# Altium schematic sheet Sheet1.SchDoc
size A4; SheetNumber: 1; SheetTotal: 1
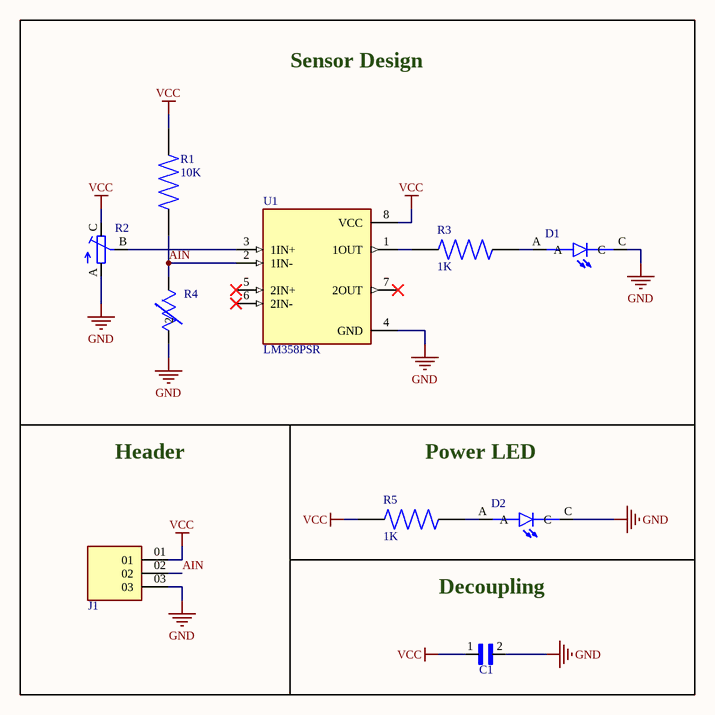
[diagram p0: Sheet1.SchDoc]

## Parts
C1  CEU4J2X7R1H104K125AE  [CAPC2012X150N]  (value not drawn)
D1  597-3305-607F  [LEDC2012X70N]  (value not drawn)
D2  597-3305-607F  [LEDC2012X70N]  (value not drawn)
J1  MTLW-103-XX-XX-S-XXX  [SAMTEC_MTLW-103-XX-XX-S-XXX]  (value not drawn)
R1  10K  [RES_ERJU06J102V]
R2  T93YA103KT20  [TRIM_T93YA103KT20]  (value not drawn)
R3  1K  [RES_ERJU06J102V]
R4  MF52A1103F3380  [TRES_MF52-A_CTM]  (value not drawn)
R5  1K  [RES_ERJU06J102V]
U1  LM358PSR  [SOIC127P780X200-8N]

## Blocks framed on the sheet
Sensor Design: D1 R1-R4 U1
Header: J1
Power LED: D2 R5
Decoupling: C1

## Nets
GND: C1.2 D1.C D2.C J1.03 R2.A R4.2 U1.4(GND)
VCC: C1.1 J1.01 R1.2 R2.C R5.1 U1.8(VCC)
AIN: J1.02 R1.1 R4.1 U1.2(1IN-)
NetD1_A: D1.A R3.2
NetD2_A: D2.A R5.2
NetR2_B: R2.B U1.3(1IN+)
NetR3_1: R3.1 U1.1(1OUT)

Not connected (* = marked no-connect by the designer): U1 5(2IN+)* 6(2IN-)* 7(2OUT)*

## Library data of the parts
C1 = CEU4J2X7R1H104K125AE: 0.1 ÂµF Â±10% 50V Ceramic Capacitor X7R 0805 (2012 Metric); MF: TDK; Value: *; Availability: In Stock; SnapEDA_Link: https://www.snapeda.com/parts/CEU4J2X7R1H104K125AE/TDK/view-part/?ref=snap; Check_prices: https://www.snapeda.com/parts/CEU4J2X7R1H104K125AE/TDK/view-part/?ref=eda; Package: 2012 TDK; Purchase-URL: https://pricing.snapeda.com/search/part/CEU4J2X7R1H104K125AE/?ref=eda; MP: CEU4J2X7R1H104K125AE; Price: None
D1 D2 = 597-3305-607F: LED Uni-Color Green 4-Pin Chip 0805 T/R; Availability: Unavailable; Value: *; Price: None; MP: 597-3305-607F; Package: None
J1 = MTLW-103-XX-XX-S-XXX: Connector Header Through Hole 40 position 0.100" (2.54mm); Package: None; Price: None; Value: *; MP: MTLW-103-XX-XX-S-XXX; Availability: Unavailable
R1 R3 R5 = ERJU06J102V: Availability: Unavailable; Value: *; Price: None; MP: ERJU06J102V; Package: None
R2 = T93YA103KT20: 10 kOhms 0.5W, 1/2W PC Pins Through Hole Trimmer Potentiometer Cermet 21.0 Turn Top Adjustment; MF: Vishay; SnapEDA_Link: https://www.snapeda.com/parts/T93YA103KT20/Vishay+Sfernice/view-part/?ref=snap; Package: TSOP-32338 Vishay; Value: *; MP: T93YA103KT20; Check_prices: https://www.snapeda.com/parts/T93YA103KT20/Vishay+Sfernice/view-part/?ref=eda
R4 = MF52A1103F3380: THERMISTOR NTC 10KOHM 3380K BEAD; MF: Cantherm; SnapEDA_Link: https://www.snapeda.com/parts/MF52A1103F3380/Cantherm/view-part/?ref=snap; Package: Bead Cantherm; Value: *; MP: MF52A1103F3380; Check_prices: https://www.snapeda.com/parts/MF52A1103F3380/Cantherm/view-part/?ref=eda
U1 = LM358PSR: Dual, 30-V, 700-kHz operational amplifier; MF: Texas Instruments; SnapEDA_Link: https://www.snapeda.com/parts/LM358PSR/Texas+Instruments/view-part/?ref=snap; Package: SOP-8 Texas Instruments; Value: *; MP: LM358PSR; Check_prices: https://www.snapeda.com/parts/LM358PSR/Texas+Instruments/view-part/?ref=eda